# EAGLE design fpgadev_0_2 (EAGLE 5.10)
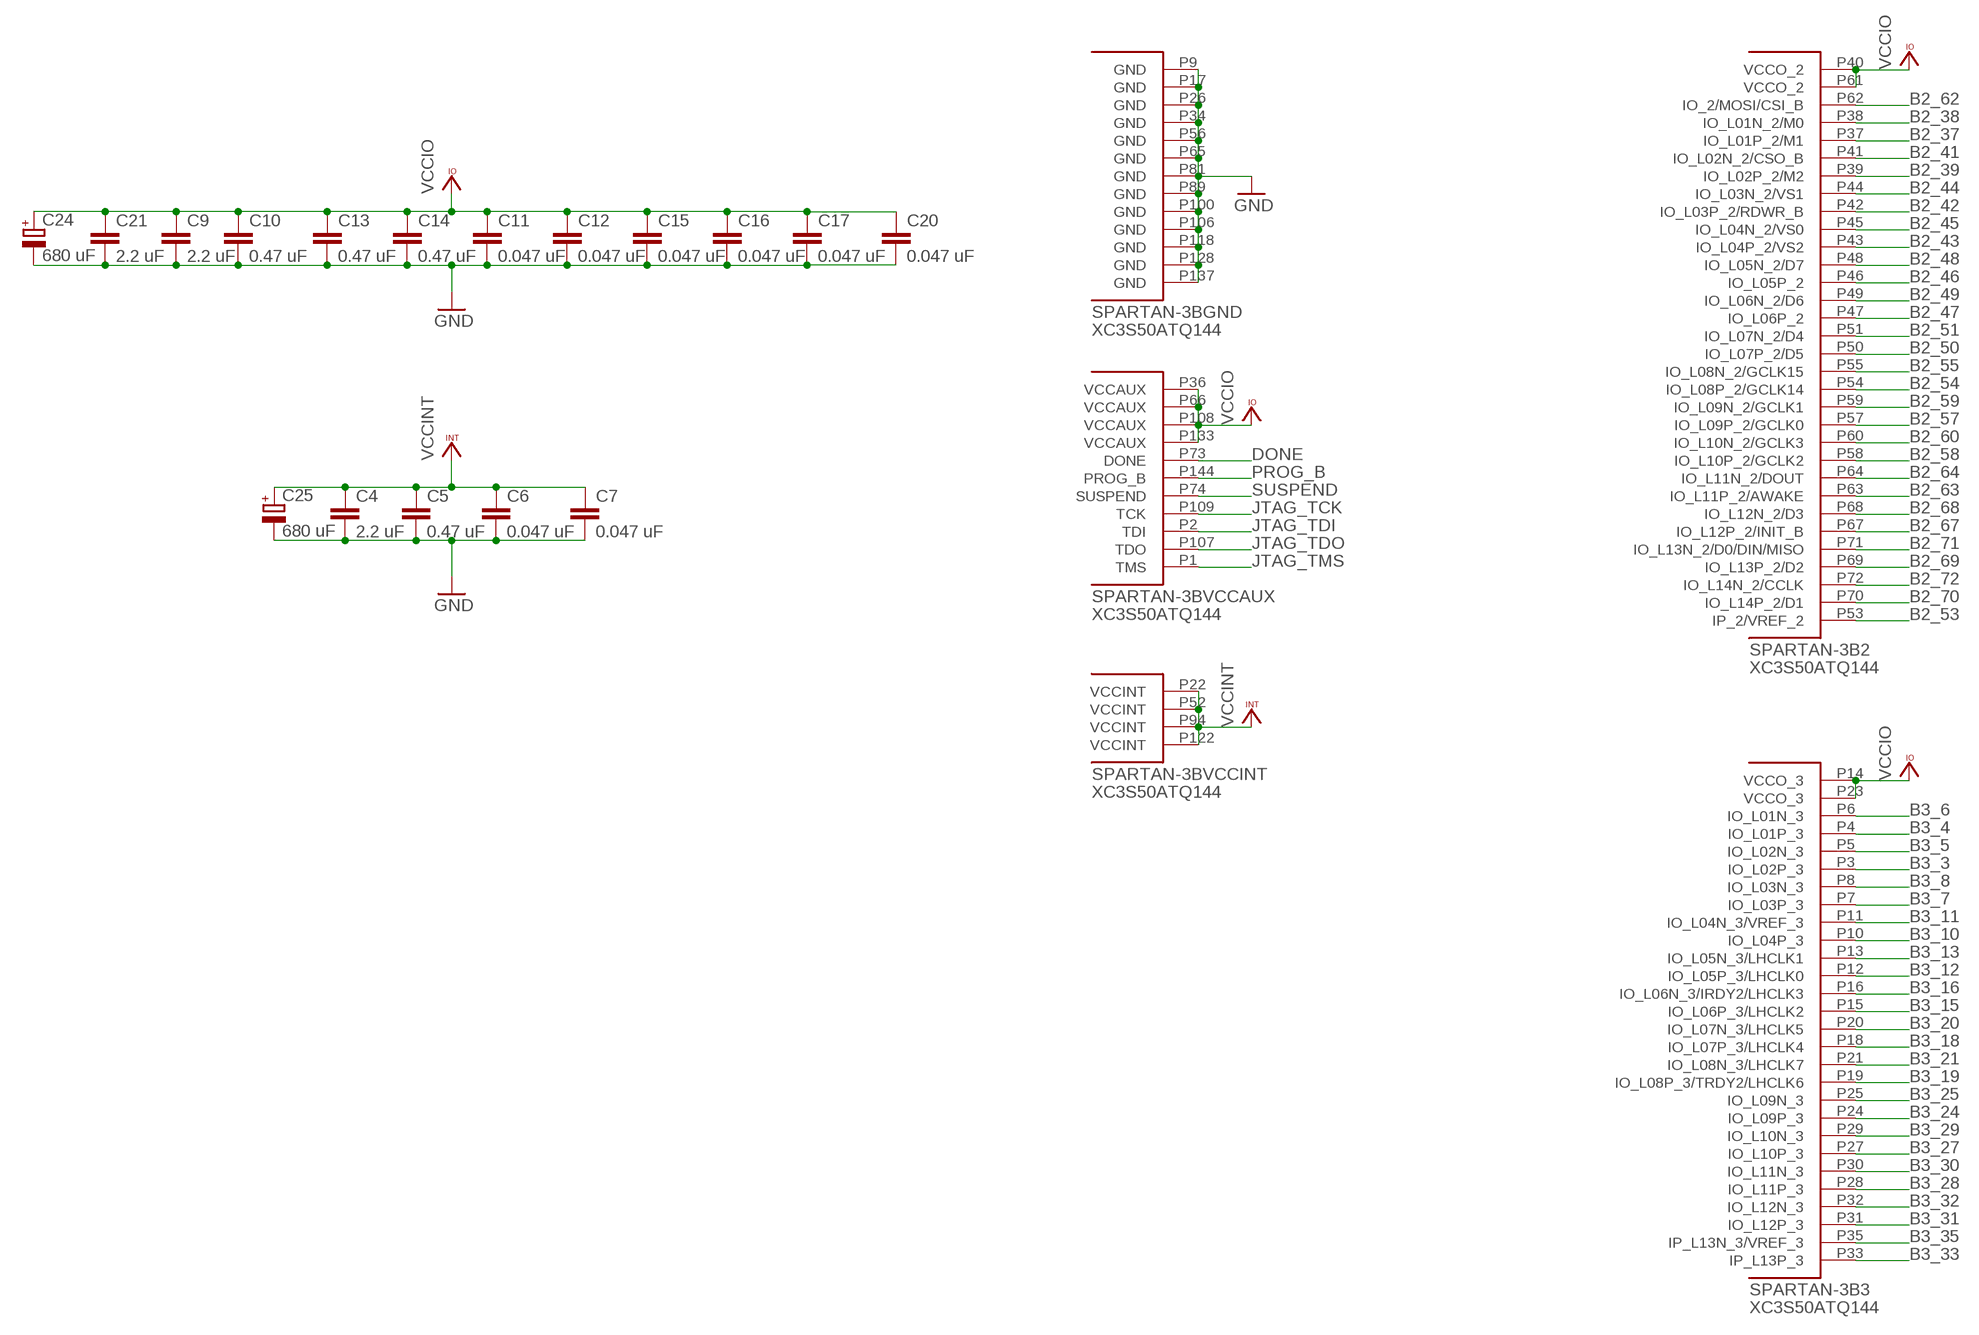
[diagram p0: schematic, sheet 1, part 1 of 2]
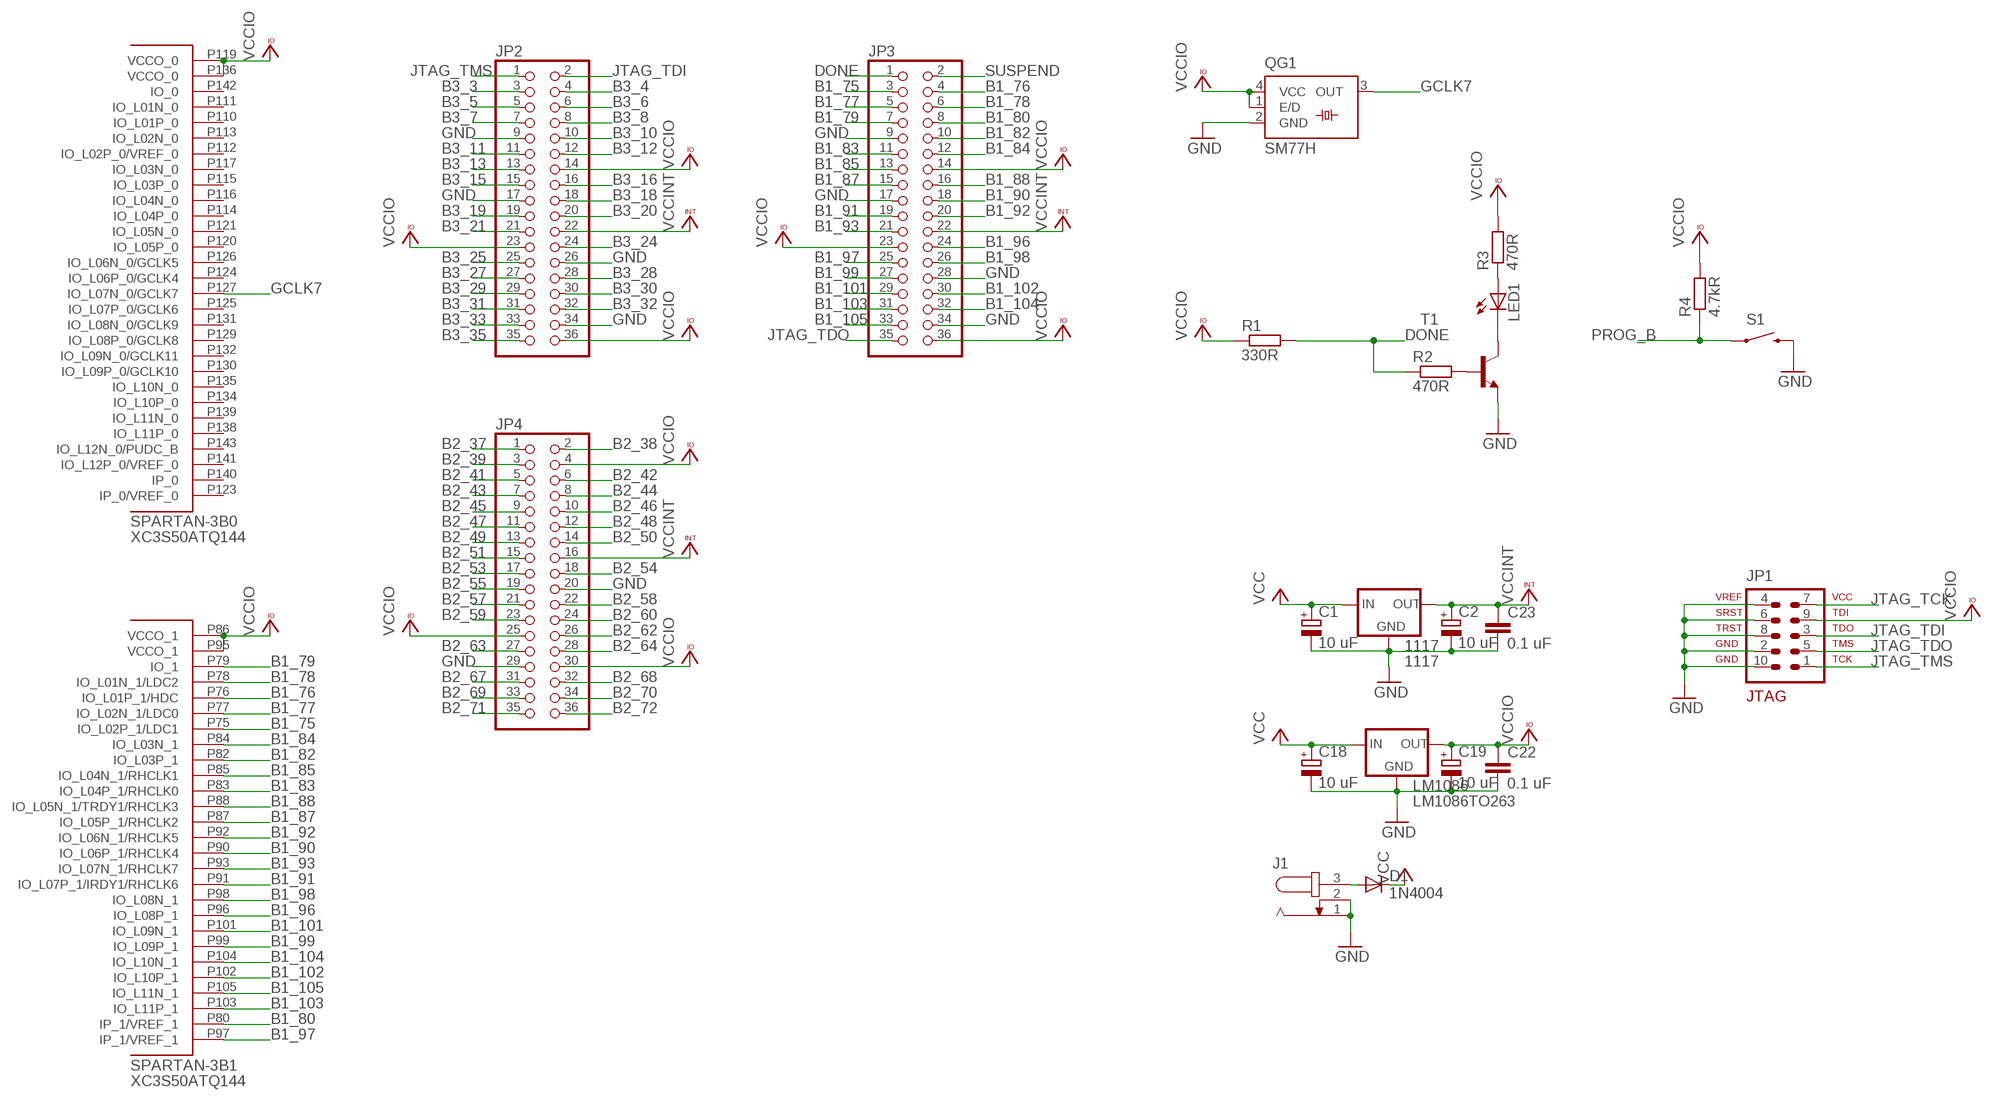
[diagram p1: schematic, sheet 1, part 2 of 2]

## Parts
1117  1117  LM1117TO252  [TO252]
C1  10 uF  CPOL-EUA/3216-18R  [A/3216-18R]
C2  10 uF  CPOL-EUA/3216-18R  [A/3216-18R]
C4  2.2 uF  C-EUC0805  [C0805]
C5  0.47 uF  C-EUC0603  [C0603]
C6  0.047 uF  C-EUC0402  [C0402]
C7  0.047 uF  C-EUC0402  [C0402]
C9  2.2 uF  C-EUC0805  [C0805]
C10  0.47 uF  C-EUC0603  [C0603]
C11  0.047 uF  C-EUC0402  [C0402]
C12  0.047 uF  C-EUC0402  [C0402]
C13  0.47 uF  C-EUC0603  [C0603]
C14  0.47 uF  C-EUC0603  [C0603]
C15  0.047 uF  C-EUC0402  [C0402]
C16  0.047 uF  C-EUC0402  [C0402]
C17  0.047 uF  C-EUC0402  [C0402]
C18  10 uF  CPOL-EUA/3216-18R  [A/3216-18R]
C19  10 uF  CPOL-EUA/3216-18R  [A/3216-18R]
C20  0.047 uF  C-EUC0402  [C0402]
C21  2.2 uF  C-EUC0805  [C0805]
C22  0.1 uF  C-EUC0805  [C0805]
C23  0.1 uF  C-EUC0805  [C0805]
C24  680 uF  CPOL-EUCT7343  [CT7343]
C25  680 uF  CPOL-EUCT7343  [CT7343]
D1  1N4004  [DO41-10]
J1  JACK-PLUG0  [SPC4077]
JP1  AVR-JTAG-10  [AVR-JTAG-10]
JP2  PINHD-2X18  [2X18]
JP3  PINHD-2X18  [2X18]
JP4  PINHD-2X18  [2X18]
LED1  LEDCHIP-LED0805  [CHIP-LED0805]
LM1086  LM1086TO263  [TO263]
QG1  SM77H  [SM77H]
R1  330R  R-EU_R0805  [R0805]
R2  470R  R-EU_R0805  [R0805]
R3  470R  R-EU_R0805  [R0805]
R4  4.7kR  R-EU_R0805  [R0805]
S1  SWITCH-MOMENTARY-2SMD  [TACTILE_SWITCH_SMD]
SPARTAN-3  XC3S50ATQ144  [TQ144]
T1  -NPN-SOT23-EBC  [SOT23-EBC]

## Nets
B1_75: JP3.3 SPARTAN-3.P75(B1:IO_L02P_1/LDC1)
B1_76: JP3.4 SPARTAN-3.P76(B1:IO_L01P_1/HDC)
B1_77: JP3.5 SPARTAN-3.P77(B1:IO_L02N_1/LDC0)
B1_78: JP3.6 SPARTAN-3.P78(B1:IO_L01N_1/LDC2)
B1_79: JP3.7 SPARTAN-3.P79(B1:IO_1)
B1_80: JP3.8 SPARTAN-3.P80(B1:IP_1/VREF_1)
B1_82: JP3.10 SPARTAN-3.P82(B1:IO_L03P_1)
B1_83: JP3.11 SPARTAN-3.P83(B1:IO_L04P_1/RHCLK0)
B1_84: JP3.12 SPARTAN-3.P84(B1:IO_L03N_1)
B1_85: JP3.13 SPARTAN-3.P85(B1:IO_L04N_1/RHCLK1)
B1_87: JP3.15 SPARTAN-3.P87(B1:IO_L05P_1/RHCLK2)
B1_88: JP3.16 SPARTAN-3.P88(B1:IO_L05N_1/TRDY1/RHCLK3)
B1_90: JP3.18 SPARTAN-3.P90(B1:IO_L06P_1/RHCLK4)
B1_91: JP3.19 SPARTAN-3.P91(B1:IO_L07P_1/IRDY1/RHCLK6)
B1_92: JP3.20 SPARTAN-3.P92(B1:IO_L06N_1/RHCLK5)
B1_93: JP3.21 SPARTAN-3.P93(B1:IO_L07N_1/RHCLK7)
B1_96: JP3.24 SPARTAN-3.P96(B1:IO_L08P_1)
B1_97: JP3.25 SPARTAN-3.P97(B1:IP_1/VREF_1)
B1_98: JP3.26 SPARTAN-3.P98(B1:IO_L08N_1)
B1_99: JP3.27 SPARTAN-3.P99(B1:IO_L09P_1)
B1_101: JP3.29 SPARTAN-3.P101(B1:IO_L09N_1)
B1_102: JP3.30 SPARTAN-3.P102(B1:IO_L10P_1)
B1_103: JP3.31 SPARTAN-3.P103(B1:IO_L11P_1)
B1_104: JP3.32 SPARTAN-3.P104(B1:IO_L10N_1)
B1_105: JP3.33 SPARTAN-3.P105(B1:IO_L11N_1)
B2_37: JP4.1 SPARTAN-3.P37(B2:IO_L01P_2/M1)
B2_38: JP4.2 SPARTAN-3.P38(B2:IO_L01N_2/M0)
B2_39: JP4.3 SPARTAN-3.P39(B2:IO_L02P_2/M2)
B2_41: JP4.5 SPARTAN-3.P41(B2:IO_L02N_2/CSO_B)
B2_42: JP4.6 SPARTAN-3.P42(B2:IO_L03P_2/RDWR_B)
B2_43: JP4.7 SPARTAN-3.P43(B2:IO_L04P_2/VS2)
B2_44: JP4.8 SPARTAN-3.P44(B2:IO_L03N_2/VS1)
B2_45: JP4.9 SPARTAN-3.P45(B2:IO_L04N_2/VS0)
B2_46: JP4.10 SPARTAN-3.P46(B2:IO_L05P_2)
B2_47: JP4.11 SPARTAN-3.P47(B2:IO_L06P_2)
B2_48: JP4.12 SPARTAN-3.P48(B2:IO_L05N_2/D7)
B2_49: JP4.13 SPARTAN-3.P49(B2:IO_L06N_2/D6)
B2_50: JP4.14 SPARTAN-3.P50(B2:IO_L07P_2/D5)
B2_51: JP4.15 SPARTAN-3.P51(B2:IO_L07N_2/D4)
B2_53: JP4.17 SPARTAN-3.P53(B2:IP_2/VREF_2)
B2_54: JP4.18 SPARTAN-3.P54(B2:IO_L08P_2/GCLK14)
B2_55: JP4.19 SPARTAN-3.P55(B2:IO_L08N_2/GCLK15)
B2_57: JP4.21 SPARTAN-3.P57(B2:IO_L09P_2/GCLK0)
B2_58: JP4.22 SPARTAN-3.P58(B2:IO_L10P_2/GCLK2)
B2_59: JP4.23 SPARTAN-3.P59(B2:IO_L09N_2/GCLK1)
B2_60: JP4.24 SPARTAN-3.P60(B2:IO_L10N_2/GCLK3)
B2_62: JP4.26 SPARTAN-3.P62(B2:IO_2/MOSI/CSI_B)
B2_63: JP4.27 SPARTAN-3.P63(B2:IO_L11P_2/AWAKE)
B2_64: JP4.28 SPARTAN-3.P64(B2:IO_L11N_2/DOUT)
B2_67: JP4.31 SPARTAN-3.P67(B2:IO_L12P_2/INIT_B)
B2_68: JP4.32 SPARTAN-3.P68(B2:IO_L12N_2/D3)
B2_69: JP4.33 SPARTAN-3.P69(B2:IO_L13P_2/D2)
B2_70: JP4.34 SPARTAN-3.P70(B2:IO_L14P_2/D1)
B2_71: JP4.35 SPARTAN-3.P71(B2:IO_L13N_2/D0/DIN/MISO)
B2_72: JP4.36 SPARTAN-3.P72(B2:IO_L14N_2/CCLK)
B3_3: JP2.3 SPARTAN-3.P3(B3:IO_L02P_3)
B3_4: JP2.4 SPARTAN-3.P4(B3:IO_L01P_3)
B3_5: JP2.5 SPARTAN-3.P5(B3:IO_L02N_3)
B3_6: JP2.6 SPARTAN-3.P6(B3:IO_L01N_3)
B3_7: JP2.7 SPARTAN-3.P7(B3:IO_L03P_3)
B3_8: JP2.8 SPARTAN-3.P8(B3:IO_L03N_3)
B3_10: JP2.10 SPARTAN-3.P10(B3:IO_L04P_3)
B3_11: JP2.11 SPARTAN-3.P11(B3:IO_L04N_3/VREF_3)
B3_12: JP2.12 SPARTAN-3.P12(B3:IO_L05P_3/LHCLK0)
B3_13: JP2.13 SPARTAN-3.P13(B3:IO_L05N_3/LHCLK1)
B3_15: JP2.15 SPARTAN-3.P15(B3:IO_L06P_3/LHCLK2)
B3_16: JP2.16 SPARTAN-3.P16(B3:IO_L06N_3/IRDY2/LHCLK3)
B3_18: JP2.18 SPARTAN-3.P18(B3:IO_L07P_3/LHCLK4)
B3_19: JP2.19 SPARTAN-3.P19(B3:IO_L08P_3/TRDY2/LHCLK6)
B3_20: JP2.20 SPARTAN-3.P20(B3:IO_L07N_3/LHCLK5)
B3_21: JP2.21 SPARTAN-3.P21(B3:IO_L08N_3/LHCLK7)
B3_24: JP2.24 SPARTAN-3.P24(B3:IO_L09P_3)
B3_25: JP2.25 SPARTAN-3.P25(B3:IO_L09N_3)
B3_27: JP2.27 SPARTAN-3.P27(B3:IO_L10P_3)
B3_28: JP2.28 SPARTAN-3.P28(B3:IO_L11P_3)
B3_29: JP2.29 SPARTAN-3.P29(B3:IO_L10N_3)
B3_30: JP2.30 SPARTAN-3.P30(B3:IO_L11N_3)
B3_31: JP2.31 SPARTAN-3.P31(B3:IO_L12P_3)
B3_32: JP2.32 SPARTAN-3.P32(B3:IO_L12N_3)
B3_33: JP2.33 SPARTAN-3.P33(B3:IP_L13P_3)
B3_35: JP2.35 SPARTAN-3.P35(B3:IP_L13N_3/VREF_3)
DONE: JP3.1 R1.2 R2.1 SPARTAN-3.P73(BVCCAUX:DONE)
GCLK7: QG1.3(OUT) SPARTAN-3.P127(B0:IO_L07N_0/GCLK7)
GND: 1117.1(GND) C1.- C2.- C4.2 C5.2 C6.2 C7.2 C9.2 C10.2 C11.2 C12.2 C13.2 C14.2 C15.2 C16.2 C17.2 C18.- C19.- C20.2 C21.2 C22.2 C23.2 C24.- C25.- J1.1 J1.2 JP1.2 JP1.4 JP1.6 JP1.8 JP1.10 JP2.9 JP2.17 JP2.26 JP2.34 JP3.9 JP3.17 JP3.28 JP3.34 JP4.20 JP4.29 LM1086.1(GND) QG1.2(GND) S1.3 SPARTAN-3.P9(BGND:GND) SPARTAN-3.P17(BGND:GND) SPARTAN-3.P26(BGND:GND) SPARTAN-3.P34(BGND:GND) SPARTAN-3.P56(BGND:GND) SPARTAN-3.P65(BGND:GND) SPARTAN-3.P81(BGND:GND) SPARTAN-3.P89(BGND:GND) SPARTAN-3.P100(BGND:GND) SPARTAN-3.P106(BGND:GND) SPARTAN-3.P118(BGND:GND) SPARTAN-3.P128(BGND:GND) SPARTAN-3.P137(BGND:GND) T1.E
JTAG_TCK: JP1.7 SPARTAN-3.P109(BVCCAUX:TCK)
JTAG_TDI: JP1.3 JP2.2 SPARTAN-3.P2(BVCCAUX:TDI)
JTAG_TDO: JP1.5 JP3.35 SPARTAN-3.P107(BVCCAUX:TDO)
JTAG_TMS: JP1.1 JP2.1 SPARTAN-3.P1(BVCCAUX:TMS)
N$1: D1.A J1.3
N$4: R2.2 T1.B
N$5: LED1.C T1.C
N$6: LED1.A R3.1
PROG_B: R4.1 S1.1 SPARTAN-3.P144(BVCCAUX:PROG_B)
SUSPEND: JP3.2 SPARTAN-3.P74(BVCCAUX:SUSPEND)
VCC: 1117.2(IN) C1.+ C18.+ D1.C LM1086.3(IN)
VCCINT: 1117.3(OUT) C2.+ C4.1 C5.1 C6.1 C7.1 C23.1 C25.+ JP2.22 JP3.22 JP4.16 SPARTAN-3.P22(BVCCINT:VCCINT) SPARTAN-3.P52(BVCCINT:VCCINT) SPARTAN-3.P94(BVCCINT:VCCINT) SPARTAN-3.P122(BVCCINT:VCCINT)
VCCIO: C9.1 C10.1 C11.1 C12.1 C13.1 C14.1 C15.1 C16.1 C17.1 C19.+ C20.1 C21.1 C22.1 C24.+ JP1.9 JP2.14 JP2.23 JP2.36 JP3.14 JP3.23 JP3.36 JP4.4 JP4.25 JP4.30 LM1086.2(OUT) QG1.1(E/D) QG1.4(VCC) R1.1 R3.2 R4.2 SPARTAN-3.P14(B3:VCCO_3) SPARTAN-3.P23(B3:VCCO_3) SPARTAN-3.P36(BVCCAUX:VCCAUX) SPARTAN-3.P40(B2:VCCO_2) SPARTAN-3.P61(B2:VCCO_2) SPARTAN-3.P66(BVCCAUX:VCCAUX) SPARTAN-3.P86(B1:VCCO_1) SPARTAN-3.P95(B1:VCCO_1) SPARTAN-3.P108(BVCCAUX:VCCAUX) SPARTAN-3.P119(B0:VCCO_0) SPARTAN-3.P133(BVCCAUX:VCCAUX) SPARTAN-3.P136(B0:VCCO_0)
Unconnected: SPARTAN-3.P110(B0:IO_L01P_0) SPARTAN-3.P111(B0:IO_L01N_0) SPARTAN-3.P112(B0:IO_L02P_0/VREF_0) SPARTAN-3.P113(B0:IO_L02N_0) SPARTAN-3.P114(B0:IO_L04P_0) SPARTAN-3.P115(B0:IO_L03P_0) SPARTAN-3.P116(B0:IO_L04N_0) SPARTAN-3.P117(B0:IO_L03N_0) SPARTAN-3.P120(B0:IO_L05P_0) SPARTAN-3.P121(B0:IO_L05N_0) SPARTAN-3.P123(B0:IP_0/VREF_0) SPARTAN-3.P124(B0:IO_L06P_0/GCLK4) SPARTAN-3.P125(B0:IO_L07P_0/GCLK6) SPARTAN-3.P126(B0:IO_L06N_0/GCLK5) SPARTAN-3.P129(B0:IO_L08P_0/GCLK8) SPARTAN-3.P130(B0:IO_L09P_0/GCLK10) SPARTAN-3.P131(B0:IO_L08N_0/GCLK9) SPARTAN-3.P132(B0:IO_L09N_0/GCLK11) SPARTAN-3.P134(B0:IO_L10P_0) SPARTAN-3.P135(B0:IO_L10N_0) SPARTAN-3.P138(B0:IO_L11P_0) SPARTAN-3.P139(B0:IO_L11N_0) SPARTAN-3.P140(B0:IP_0) SPARTAN-3.P141(B0:IO_L12P_0/VREF_0) SPARTAN-3.P142(B0:IO_0) SPARTAN-3.P143(B0:IO_L12N_0/PUDC_B)

## Library data of the parts
1117 = v-reg-2:LM1117
C1 C2 C18 C19 C24 C25 = rcl:CPOL-EU: POLARIZED CAPACITOR, European symbol
C4-C7 C9-C17 C20-C23 = rcl:C-EU: CAPACITOR, European symbol
D1 = diode:1N4004: DIODE general purpose rectifier, 1 A
J1 = con-jack:JACK-PLUG: DC POWER JACK Power Jack, DC, Right Angle, Through Hole, Rated 5A at 16VDC, PC Terminals Distributor: Farnell (www.Farnell.de) Drawing: 84N1161.pdf / 84N1162.pdf Manufacturer: SPC Technology (www.spctechnology.com) Type: SPC4077 / SPC 4078
JP1 = atmel-1:AVR-JTAG-10: AVR JTAG Debug/Programming Header
JP2-JP4 = pinhead:PINHD-2X18: PIN HEADER
LED1 = led:LED: LED OSRAM: - CHIPLED LG R971, LG N971, LY N971, LG Q971, LY Q971, LO R971, LY R971 LH N974, LH R974 LS Q976, LO Q976, LY Q976 LO Q996 - Hyper CHIPLED LW Q18S LB Q993, LB Q99A, LB R99A - SideLED LS A670, LO A670, LY A670, LG A670, LP A670 LB A673, LV A673, LT A673, LW A673 LH A674 LY A675 LS A676, LA A676, LO A676, LY A676, LW A676 LS A679, LY A679, LG A679 - Hyper Micro SIDELED® LS Y876, LA Y876, LO Y876, LY Y876 LT Y87S - SmartLED LW L88C, LW L88S LB L89C, LB L89S, LG L890 LS L89K, LO L89K, LY L89K LS L896, LA L896, LO L896, LY L896 - TOPLED LS T670, LO T670, LY T670, LG T670, LP T670 LSG T670, LSP T670, LSY T670, LOP T670, LYG T670 LG T671, LOG T671, LSG T671 LB T673, LV T673, LT T673, LW T673 LH T674 LS T676, LA T676, LO T676, LY T676, LB T676, LH T676, LSB T676, LW T676 LB T67C, LV T67C, LT T67C, LS T67K, LO T67K, LY T67K, LW E67C LS E67B, LA E67B, LO E67B, LY E67B, LB E67C, LV E67C, LT E67C LW T67C LS T679, LY T679, LG T679 LS T770, LO T770, LY T770, LG T770, LP T770 LB T773, LV T773, LT T773, LW T773 LH T774 LS E675, LA E675, LY E675, LS T675 LS T776, LA T776, LO T776, LY T776, LB T776 LHGB T686 LT T68C, LB T68C - Hyper Mini TOPLED® LB M676 - Mini TOPLED Santana® LG M470 LS M47K, LO M47K, LY M47K Source: http://www.osram.convergy.de LUXEON: - LUMILED® LXK2-PW12-R00, LXK2-PW12-S00, LXK2-PW14-U00, LXK2-PW14-V00 LXK2-PM12-R00, LXK2-PM12-S00, LXK2-PM14-U00 LXK2-PE12-Q00, LXK2-PE12-R00, LXK2-PE12-S00, LXK2-PE14-T00, LXK2-PE14-U00 LXK2-PB12-K00, LXK2-PB12-L00, LXK2-PB12-M00, LXK2-PB14-N00, LXK2-PB14-P00, LXK2-PB14-Q00 LXK2-PR12-L00, LXK2-PR12-M00, LXK2-PR14-Q00, LXK2-PR14-R00 LXK2-PD12-Q00, LXK2-PD12-R00, LXK2-PD12-S00 LXK2-PH12-R00, LXK2-PH12-S00 LXK2-PL12-P00, LXK2-PL12-Q00, LXK2-PL12-R00 Source: www.luxeon.com KINGBRIGHT: KA-3528ASYC Source: www.kingbright.com
LM1086 = v-reg-2:LM1086
QG1 = crystal:SM77H: 3.3V CMOS Clock Oscillator Source: www.pletronics.com .. sm77h%203.3v.pdf
R1-R4 = rcl:R-EU_: RESISTOR, European symbol
S1 = SparkFun:SWITCH-MOMENTARY-2
SPARTAN-3 = xilinx_devices:XC3S50ATQ144: Xilinx FPGA: XC3S50ATQ144
T1 = transistor:*-NPN-: NPN Transistror BF959 corrected 2008.03.06

## Board
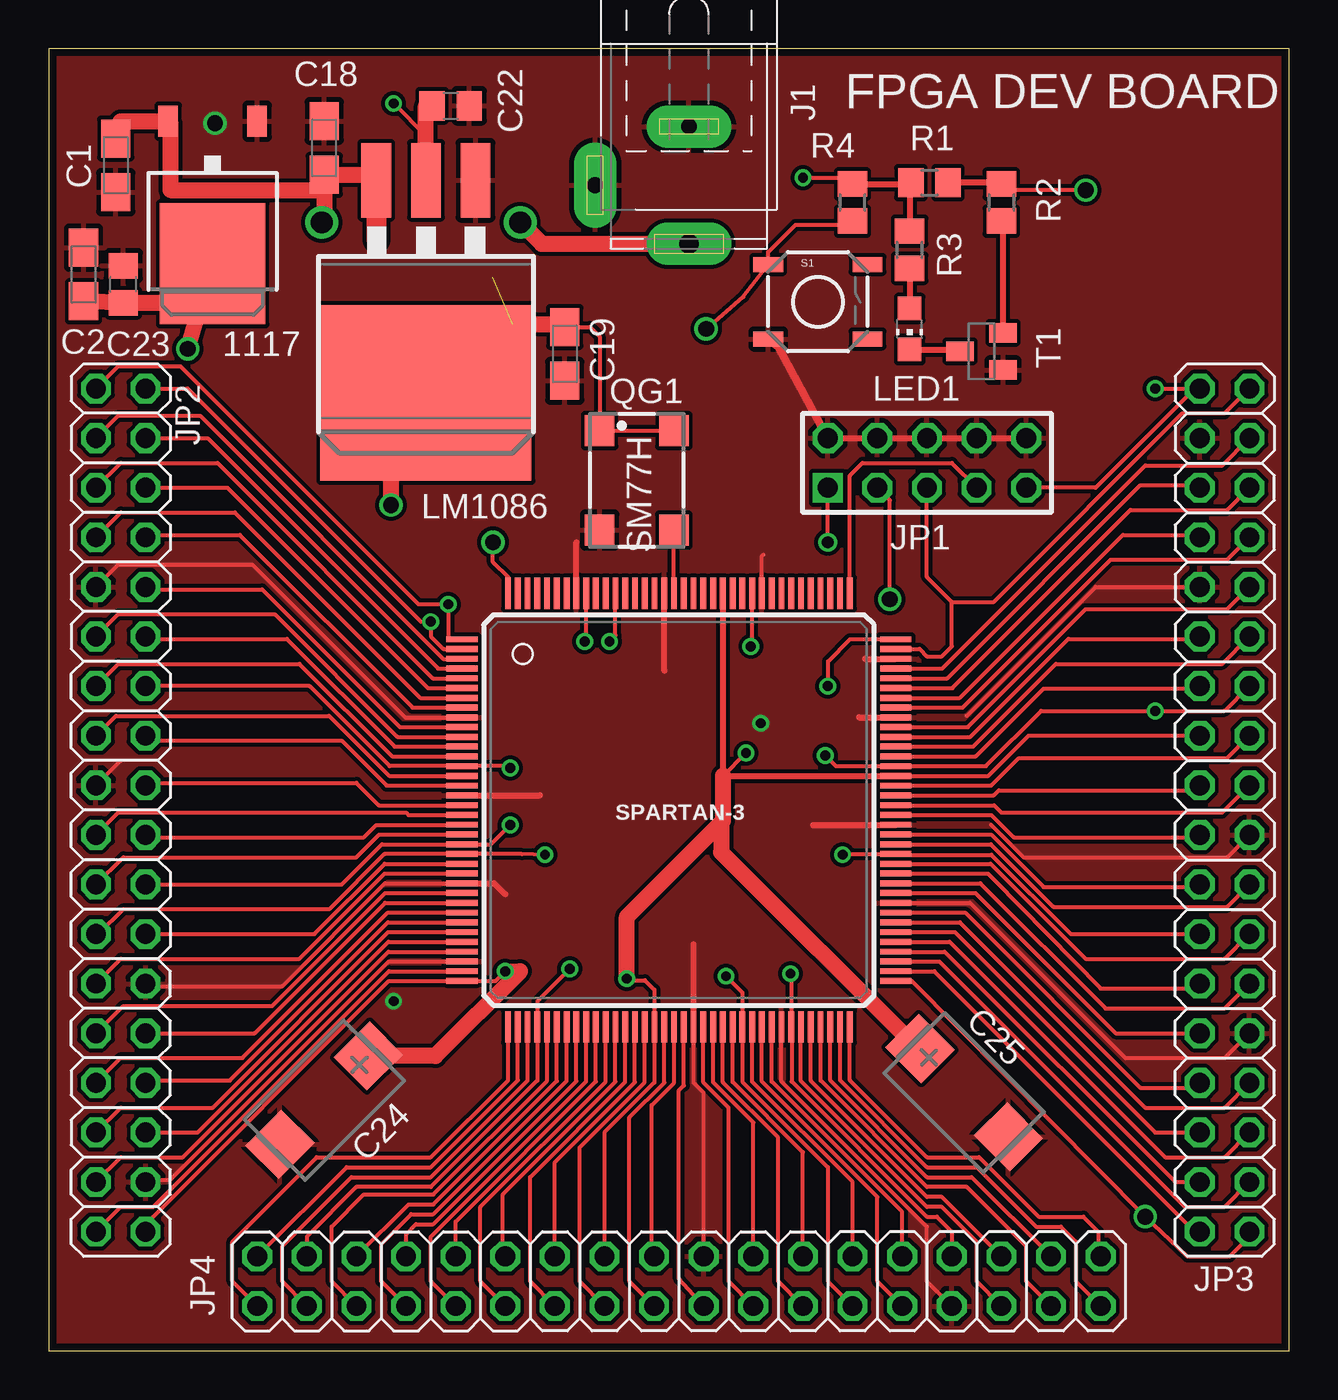
[diagram p2: board, top side]
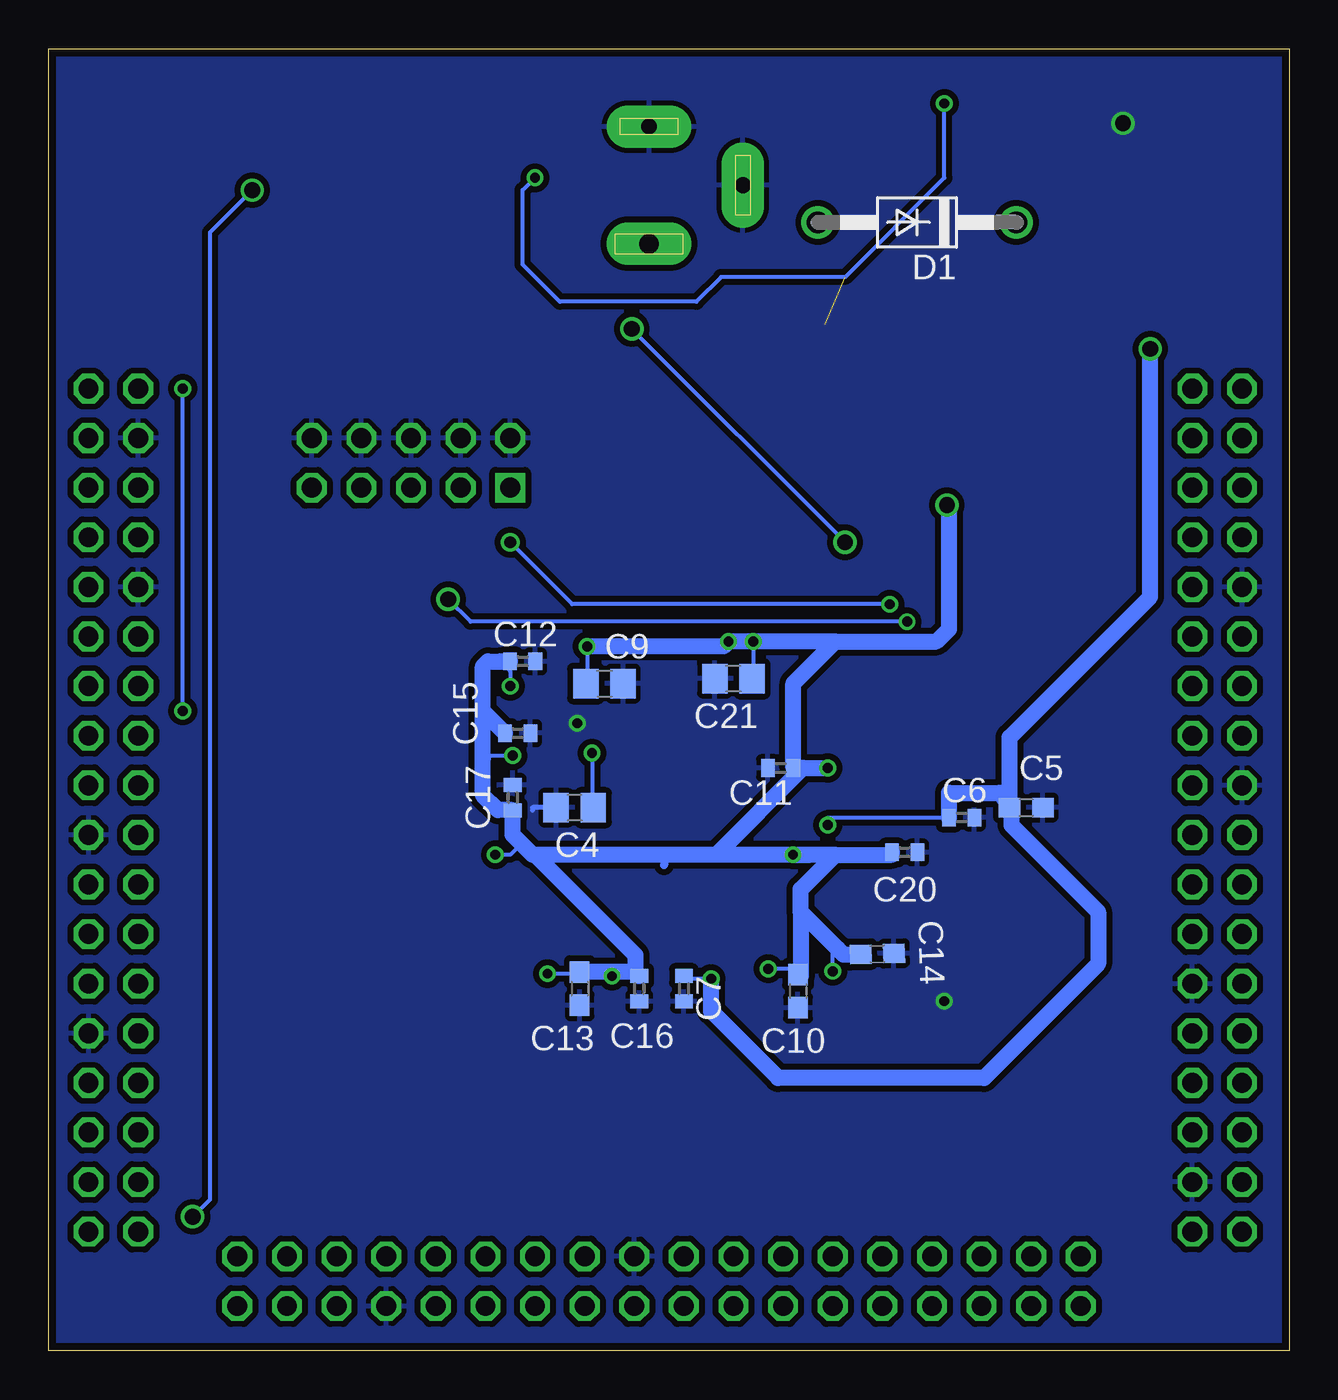
[diagram p3: board, bottom side, seen from below]

Size 63.5 x 66.67 mm. Coordinates in mm from the lower left corner, seen from the top.
Outline: 0,0 63.5,0 63.5,66.67 0,66.67 0,0
Copper layers (1*16): Top 0.0356mm / dielectric 1.5011mm / Bottom 0.0356mm
Design rules "LaenPCBOrder": minimum track width 6mil, minimum drill 13mil, track to track 6mil, track to pad 6mil, pad to pad 6mil, via to via 6mil, smd to smd 6mil, copper to edge 15mil, drill to drill 6mil, minimum pad ring 7mil, minimum via ring 7mil, stop-mask expansion 4mil, vias tented up to drill 0mil, thermal gap 10mil

### Footprints (pad centres in the part's own frame; a part is rotated, then mirrored left to right if it is on the bottom)
TO252 = smd 1 x 1.6: 1 -2.28,-6.07; 2 2.28,-6.07 | smd 5.4 x 6.2: 3 0,1.23
A/3216-18R = smd 1.95 x 1.5: + 1.375,0; - -1.375,0
C0805 = smd 1.3 x 1.5: 1 -0.95,0; 2 0.95,0
C0603 = smd 1.1 x 1: 1 -0.85,0; 2 0.85,0
C0402 = smd 0.7 x 0.9: 1 -0.65,0; 2 0.65,0
CT7343 = smd 2.6 x 2.4: + -3.2,0; - 3.2,0
DO41-10 = drill 1.118 round: A 5.08,0; C -5.08,0
SPC4077 = drill 0.8 pad 2.184 long: 1 -3,0; 2 0,-4.8 | drill 1 pad 2.184 long: 3 3,0
AVR-JTAG-10 = drill 1.016 square: 1 -5.08,-1.27 | drill 1.016 octagon: 2 -5.08,1.27; 3 -2.54,-1.27; 4 -2.54,1.27; 5 0,-1.27; 6 0,1.27; 7 2.54,-1.27; 8 2.54,1.27; 9 5.08,-1.27; 10 5.08,1.27
2X18 = drill 1.016 octagon: 1 -21.59,-1.27; 2 -21.59,1.27; 3 -19.05,-1.27; 4 -19.05,1.27; 5 -16.51,-1.27; 6 -16.51,1.27; 7 -13.97,-1.27; 8 -13.97,1.27; 9 -11.43,-1.27; 10 -11.43,1.27; 11 -8.89,-1.27; 12 -8.89,1.27; 13 -6.35,-1.27; 14 -6.35,1.27; 15 -3.81,-1.27; 16 -3.81,1.27; 17 -1.27,-1.27; 18 -1.27,1.27; 19 1.27,-1.27; 20 1.27,1.27; 21 3.81,-1.27; 22 3.81,1.27; 23 6.35,-1.27; 24 6.35,1.27; 25 8.89,-1.27; 26 8.89,1.27; 27 11.43,-1.27; 28 11.43,1.27; 29 13.97,-1.27; 30 13.97,1.27; 31 16.51,-1.27; 32 16.51,1.27; 33 19.05,-1.27; 34 19.05,1.27; 35 21.59,-1.27; 36 21.59,1.27
CHIP-LED0805 = smd 1.2 x 1.2: A 0,-1.05; C 0,1.05
TO263 = smd 1.524 x 3.81: 1 -2.54,-8.255; 2 0,-8.255; 3 2.54,-8.255 | smd 10.8 x 9: 4 0,2.635
SM77H = smd 1.6 x 1.5: 1 -2.55,-1.9; 2 2.55,-1.9; 3 2.55,1.9; 4 -2.55,1.9
R0805 = smd 1.3 x 1.5: 1 -0.95,0; 2 0.95,0
TACTILE_SWITCH_SMD = smd 1.524 x 0.762: 1 -2.54,1.905; 2 2.54,1.905; 3 -2.54,-1.905; 4 2.54,-1.905
TQ144 = smd 1.6 x 0.3: P1 -11.1,8.75; P2 -11.1,8.25; P3 -11.1,7.75; P4 -11.1,7.25; P5 -11.1,6.75; P6 -11.1,6.25; P7 -11.1,5.75; P8 -11.1,5.25; P9 -11.1,4.75; P10 -11.1,4.25; P11 -11.1,3.75; P12 -11.1,3.25; P13 -11.1,2.75; P14 -11.1,2.25; P15 -11.1,1.75; P16 -11.1,1.25; P17 -11.1,0.75; P18 -11.1,0.25; P19 -11.1,-0.25; P20 -11.1,-0.75; P21 -11.1,-1.25; P22 -11.1,-1.75; P23 -11.1,-2.25; P24 -11.1,-2.75; P25 -11.1,-3.25; P26 -11.1,-3.75; P27 -11.1,-4.25; P28 -11.1,-4.75; P29 -11.1,-5.25; P30 -11.1,-5.75; P31 -11.1,-6.25; P32 -11.1,-6.75; P33 -11.1,-7.25; P34 -11.1,-7.75; P35 -11.1,-8.25; P36 -11.1,-8.75; P73 11.1,-8.75; P74 11.1,-8.25; P75 11.1,-7.75; P76 11.1,-7.25; P77 11.1,-6.75; P78 11.1,-6.25; P79 11.1,-5.75; P80 11.1,-5.25; P81 11.1,-4.75; P82 11.1,-4.25; P83 11.1,-3.75; P84 11.1,-3.25; P85 11.1,-2.75; P86 11.1,-2.25; P87 11.1,-1.75; P88 11.1,-1.25; P89 11.1,-0.75; P90 11.1,-0.25; P91 11.1,0.25; P92 11.1,0.75; P93 11.1,1.25; P94 11.1,1.75; P95 11.1,2.25; P96 11.1,2.75; P97 11.1,3.25; P98 11.1,3.75; P99 11.1,4.25; P100 11.1,4.75; P101 11.1,5.25; P102 11.1,5.75; P103 11.1,6.25; P104 11.1,6.75; P105 11.1,7.25; P106 11.1,7.75; P107 11.1,8.25; P108 11.1,8.75 | smd 0.3 x 1.6: P37 -8.75,-11.1; P38 -8.25,-11.1; P39 -7.75,-11.1; P40 -7.25,-11.1; P41 -6.75,-11.1; P42 -6.25,-11.1; P43 -5.75,-11.1; P44 -5.25,-11.1; P45 -4.75,-11.1; P46 -4.25,-11.1; P47 -3.75,-11.1; P48 -3.25,-11.1; P49 -2.75,-11.1; P50 -2.25,-11.1; P51 -1.75,-11.1; P52 -1.25,-11.1; P53 -0.75,-11.1; P54 -0.25,-11.1; P55 0.25,-11.1; P56 0.75,-11.1; P57 1.25,-11.1; P58 1.75,-11.1; P59 2.25,-11.1; P60 2.75,-11.1; P61 3.25,-11.1; P62 3.75,-11.1; P63 4.25,-11.1; P64 4.75,-11.1; P65 5.25,-11.1; P66 5.75,-11.1; P67 6.25,-11.1; P68 6.75,-11.1; P69 7.25,-11.1; P70 7.75,-11.1; P71 8.25,-11.1; P72 8.75,-11.1; P109 8.75,11.1; P110 8.25,11.1; P111 7.75,11.1; P112 7.25,11.1; P113 6.75,11.1; P114 6.25,11.1; P115 5.75,11.1; P116 5.25,11.1; P117 4.75,11.1; P118 4.25,11.1; P119 3.75,11.1; P120 3.25,11.1; P121 2.75,11.1; P122 2.25,11.1; P123 1.75,11.1; P124 1.25,11.1; P125 0.75,11.1; P126 0.25,11.1; P127 -0.25,11.1; P128 -0.75,11.1; P129 -1.25,11.1; P130 -1.75,11.1; P131 -2.25,11.1; P132 -2.75,11.1; P133 -3.25,11.1; P134 -3.75,11.1; P135 -4.25,11.1; P136 -4.75,11.1; P137 -5.25,11.1; P138 -5.75,11.1; P139 -6.25,11.1; P140 -6.75,11.1; P141 -7.25,11.1; P142 -7.75,11.1; P143 -8.25,11.1; P144 -8.75,11.1
SOT23-EBC = smd 1 x 1.4: B 0.95,-1.1; C 0,1.1; E -0.95,-1.1

### Placement (x,y rotation side)
1117  8.38,56.9 180 top
C1  3.43,60.71 90 top
C2  1.78,55.12 270 top
C4  36.58,27.81 180 bottom
C5  13.46,27.81 0 bottom
C6  16.76,27.3 0 bottom
C7  30.99,18.54 270 bottom
C9  35.05,34.16 0 bottom
C10  25.15,18.41 270 bottom
C11  26.04,29.84 180 bottom
C12  39.24,35.31 0 bottom
C13  36.32,18.54 270 bottom
C14  21.08,20.32 1.9 bottom
C15  39.5,31.62 0 bottom
C16  33.27,18.54 270 bottom
C17  39.75,28.32 90 bottom
C18  14.1,61.59 270 top
C19  26.42,51.05 90 top
C20  19.68,25.53 0 bottom
C21  28.45,34.42 180 bottom
C22  20.57,63.75 0 top
C23  3.81,54.61 90 top
C24  14.1,12.83 225 top
C25  46.86,13.21 315 top
D1  19.05,57.78 180 bottom
J1  32.77,59.69 270 top
JP1  44.96,45.47 0 top
JP2  3.68,27.69 270 top
JP3  60.2,27.69 90 top
JP4  32.26,3.56 0 top
LED1  44.07,52.32 180 top
LM1086  19.3,51.69 180 top
QG1  30.1,44.58 270 top
R1  45.09,59.82 0 top
R2  48.77,58.8 270 top
R3  44.07,56.39 90 top
R4  41.15,58.8 90 top
S1  39.37,53.72 0 top
SPARTAN-3  32.26,27.69 0 top
T1  47.75,51.18 90 top

### Tracks (layer width: path | path; a pad name or v marks a point on that pad's centre or on a via)
B1_75
  Top 0.203: SPARTAN-3.P75 45.6,19.94 58.17,7.37 60.2,7.37 JP3.3
B1_76
  Top 0.203: SPARTAN-3.P76 45.86,20.44 57.66,8.64 JP3.4
B1_77
  Top 0.203: SPARTAN-3.P77 46.12,20.94 57.15,9.91 60.2,9.91 JP3.5
B1_78
  Top 0.203: SPARTAN-3.P78 46.38,21.44 56.64,11.18 JP3.6
B1_79
  Top 0.203: SPARTAN-3.P79 46.64,21.94 56.13,12.45 60.2,12.45 JP3.7
B1_80
  Top 0.203: SPARTAN-3.P80 46.91,22.44 55.88,13.46 58.67,13.46 JP3.8
B1_82
  Top 0.203: SPARTAN-3.P82 47.43,23.44 54.61,16.26 JP3.10
B1_83
  Top 0.203: SPARTAN-3.P83 47.69,23.94 54.1,17.53 60.2,17.53 JP3.11
B1_84
  Top 0.203: 48.38,24.12 48.08,24.44 | 48.38,24.12 53.85,18.54 58.67,18.54 JP3.12 | SPARTAN-3.P84 48.07,24.44 48.38,24.12
B1_85
  Top 0.203: JP3.13 60.2,20.07 53.09,20.07 48.22,24.94 SPARTAN-3.P85
B1_87
  Top 0.203: JP3.15 60.33,22.73 51.44,22.73 48.23,25.94 SPARTAN-3.P87
B1_88
  Top 0.203: JP3.16 58.8,23.75 50.93,23.75 48.24,26.44 SPARTAN-3.P88
B1_90
  Top 0.203: SPARTAN-3.P90 48.26,27.44 49.4,26.29 58.8,26.29 JP3.18
B1_91
  Top 0.203: JP3.19 60.07,27.56 48.77,27.56 48.39,27.94 SPARTAN-3.P91
B1_92
  Top 0.203: JP3.20 58.67,28.7 48.64,28.7 48.38,28.44 44.06,28.44 | 44.06,28.44 44.07,28.45 | SPARTAN-3.P92 44.06,28.44
B1_93
  Top 0.203: JP3.21 60.33,30.35 49.66,30.35 48.24,28.94 SPARTAN-3.P93
B1_96
  Top 0.203: JP3.24 58.8,33.91 50.93,33.91 47.45,30.44 SPARTAN-3.P96
B1_97
  Top 0.203: JP3.25 60.07,35.18 51.56,35.18 47.32,30.94 SPARTAN-3.P97
B1_98
  Top 0.203: JP3.26 58.8,36.45 52.2,36.45 47.18,31.44 SPARTAN-3.P98
B1_99
  Top 0.203: JP3.27 60.33,37.97 53.09,37.97 47.05,31.94 SPARTAN-3.P99
B1_101
  Top 0.203: SPARTAN-3.P101 46.78,32.94 54.36,40.51 60.33,40.51 JP3.29
B1_102
  Top 0.203: SPARTAN-3.P102 46.64,33.44 54.99,41.78 58.8,41.78 JP3.30
B1_103
  Top 0.203: SPARTAN-3.P103 46.26,33.94 55.37,43.05 60.33,43.05 JP3.31
B1_104
  Top 0.203: SPARTAN-3.P104 45.99,34.44 55.88,44.32 58.8,44.32 JP3.32
B1_105
  Top 0.203: SPARTAN-3.P105 45.73,34.94 56.13,45.34 60.07,45.34 JP3.33
B2_37
  Top 0.203: SPARTAN-3.P37 23.51,13.86 19.56,9.91 13.72,9.91 9.4,5.59 9.4,3.56 JP4.1
B2_38
  Top 0.203: JP4.2 15.24,9.4 19.56,9.4 24.01,13.85 SPARTAN-3.P38
B2_39
  Top 0.203: JP4.3 11.94,3.56 11.94,5.33 15.49,8.89 19.56,8.89 24.51,13.84 SPARTAN-3.P39
B2_41
  Top 0.203: JP4.5 14.48,3.56 14.48,6.35 16.13,8 19.68,8 25.51,13.82 SPARTAN-3.P41
B2_42
  Top 0.203: JP4.6 18.41,7.49 19.68,7.49 26.01,13.82 SPARTAN-3.P42
B2_43
  Top 0.203: SPARTAN-3.P43 26.51,13.81 19.68,6.99 18.54,6.99 17.02,5.46 17.02,3.56 JP4.7
B2_44
  Top 0.203: SPARTAN-3.P44 27.01,13.8 19.68,6.48 18.8,6.48 18.29,5.97 JP4.8
B2_45
  Top 0.203: SPARTAN-3.P45 27.51,13.79 19.56,5.84 19.56,3.56 JP4.9
B2_46
  Top 0.203: SPARTAN-3.P46 28.01,13.78 20.83,6.6 JP4.10
B2_47
  Top 0.203: SPARTAN-3.P47 28.51,13.78 22.1,7.37 22.1,3.56 JP4.11
B2_48
  Top 0.203: SPARTAN-3.P48 29.01,13.77 23.24,8 23.24,4.95 JP4.12
B2_49
  Top 0.203: SPARTAN-3.P49 29.51,13.76 24.64,8.89 24.64,3.56 JP4.13
B2_50
  Top 0.203: JP4.14 25.91,9.65 30.01,13.75 SPARTAN-3.P50
B2_51
  Top 0.203: JP4.15 27.18,3.56 27.18,10.41 30.51,13.74 SPARTAN-3.P51
B2_53
  Top 0.203: JP4.17 29.72,3.56 29.72,11.94 31.51,13.73 SPARTAN-3.P53
B2_54
  Top 0.203: JP4.18 30.86,4.95 30.86,12.57 32.01,13.72 SPARTAN-3.P54
B2_55
  Top 0.203: SPARTAN-3.P55 32.51,13.59 32.26,13.34 32.26,3.68 JP4.19
B2_57
  Top 0.203: SPARTAN-3.P57 33.51,13.74 34.8,12.45 34.8,3.56 JP4.21
B2_58
  Top 0.203: SPARTAN-3.P58 34.01,13.74 36.07,11.68 JP4.22
B2_59
  Top 0.203: JP4.23 37.34,3.56 37.34,10.92 34.51,13.75 SPARTAN-3.P59
B2_60
  Top 0.203: JP4.24 38.61,10.16 35.01,13.76 SPARTAN-3.P60
B2_62
  Top 0.203: JP4.26 41.15,8.64 36.01,13.78 SPARTAN-3.P62
B2_63
  Top 0.203: JP4.27 42.42,3.56 42.42,7.87 36.51,13.78 SPARTAN-3.P63
B2_64
  Top 0.203: SPARTAN-3.P64 37.01,13.79 43.69,7.11 JP4.28
B2_67
  Top 0.203: JP4.31 47.5,3.56 47.5,5.59 45.72,7.37 44.96,7.37 38.51,13.82 SPARTAN-3.P67
B2_68
  Top 0.203: SPARTAN-3.P68 39.01,13.82 44.96,7.87 45.72,7.87 JP4.32
B2_69
  Top 0.203: SPARTAN-3.P69 39.51,13.83 44.96,8.38 46.99,8.38 50.04,5.33 50.04,3.56 JP4.33
B2_70
  Top 0.203: SPARTAN-3.P70 40.01,13.84 44.96,8.89 47.24,8.89 JP4.34
B2_71
  Top 0.203: SPARTAN-3.P71 40.51,13.85 44.96,9.4 47.5,9.4 50.55,6.35 51.82,6.35 52.58,5.59 52.58,3.56 JP4.35
B2_72
  Top 0.203: SPARTAN-3.P72 41.01,13.86 44.96,9.91 47.62,9.91 50.67,6.86 52.96,6.86 53.72,6.1 53.72,4.95 JP4.36
B3_3
  Top 0.203: SPARTAN-3.P3 20.19,35.44 7.75,47.88 3.56,47.88 JP2.3
B3_4
  Top 0.203: SPARTAN-3.P4 19.93,34.94 8.13,46.74 JP2.4
B3_5
  Top 0.203: SPARTAN-3.P5 19.67,34.44 8.64,45.47 3.68,45.47 JP2.5
B3_6
  Top 0.203: SPARTAN-3.P6 19.4,33.94 9.14,44.2 JP2.6
B3_7
  Top 0.203: SPARTAN-3.P7 19.02,33.44 9.53,42.93 3.68,42.93 JP2.7
B3_8
  Top 0.203: SPARTAN-3.P8 18.63,32.94 9.78,41.78 5.08,41.78 JP2.8
B3_10
  Top 0.203: SPARTAN-3.P10 17.98,31.94 10.92,38.99 5.08,38.99 JP2.10
B3_11
  Top 0.203: SPARTAN-3.P11 17.84,31.44 11.56,37.72 3.56,37.72 JP2.11
B3_12
  Top 0.203: SPARTAN-3.P12 17.7,30.94 12.19,36.45 5.08,36.45 JP2.12
B3_13
  Top 0.203: JP2.13 3.56,35.18 12.83,35.18 17.57,30.44 SPARTAN-3.P13
B3_15
  Top 0.203: JP2.15 3.43,32.51 14.35,32.51 17.43,29.44 SPARTAN-3.P15
B3_16
  Top 0.203: SPARTAN-3.P16 17.29,28.94 14.99,31.24 5.21,31.24 JP2.16
B3_18
  Top 0.203: SPARTAN-3.P18 16.89,27.94 15.75,29.08 5.08,29.08 JP2.18
B3_19
  Top 0.203: JP2.19 3.56,27.56 18.29,27.56 18.41,27.44 SPARTAN-3.P19
B3_20
  Top 0.203: JP2.20 5.08,26.29 16.13,26.29 16.76,26.92 21.15,26.92 SPARTAN-3.P20
B3_21
  Top 0.203: JP2.21 3.81,25.27 15.75,25.27 16.91,26.44 SPARTAN-3.P21
B3_24
  Top 0.203: JP2.24 13.59,21.34 17.19,24.94 SPARTAN-3.P24
B3_25
  Top 0.203: JP2.25 3.68,20.07 12.83,20.07 17.2,24.44 SPARTAN-3.P25
B3_27
  Top 0.203: SPARTAN-3.P27 17.21,23.44 11.43,17.65 3.81,17.65 JP2.27
B3_28
  Top 0.203: SPARTAN-3.P28 17.22,22.94 10.54,16.26 JP2.28
B3_29
  Top 0.203: SPARTAN-3.P29 17.36,22.44 9.91,14.99 3.68,14.99 JP2.29
B3_30
  Top 0.203: SPARTAN-3.P30 17.36,21.94 9.27,13.84 5.08,13.84 JP2.30
B3_31
  Top 0.203: SPARTAN-3.P31 17.37,21.44 8.38,12.45 3.68,12.45 JP2.31
B3_32
  Top 0.203: SPARTAN-3.P32 17.38,20.94 7.62,11.18 JP2.32
B3_33
  Top 0.203: SPARTAN-3.P33 17.39,20.44 6.86,9.91 3.68,9.91 JP2.33
B3_35
  Top 0.203: JP2.35 3.68,7.37 5.33,7.37 17.4,19.44 SPARTAN-3.P35
DONE  (via drill 0.8)
  Top 0.203: SPARTAN-3.P73 44.18,18.94 v56.13,6.86 58.29,4.83 60.45,4.83 61.47,5.84 JP3.1 | v53.09,59.44 49.08,59.44 R2.1
  Top 0.305: R1.2 48.7,59.82 R2.1
  Bottom 0.203: v53.09,59.44 55.24,57.28 55.24,7.75 v56.13,6.86
GCLK7
  Top 0.203: QG1.3 32,38.8 SPARTAN-3.P127
GND  (via drill 0.5, 0.8)
  Top 0.203: JP4.29 44.96,3.56 44.96,6.35 37.51,13.8 SPARTAN-3.P65 | SPARTAN-3.P56 33.01,13.73 33.53,13.21 JP4.20 | SPARTAN-3.P81 47.17,22.94 55.12,14.99 60.2,14.99 JP3.9 | JP3.17 60.33,25.27 49.91,25.27 48.25,26.94 | 46.99,32.51 53.59,39.12 JP3.28 | SPARTAN-3.P34 17.4,19.94 6.22,8.76 5.08,8.76 JP2.34 | SPARTAN-3.P26 17.2,23.94 11.94,18.67 5.08,18.67 JP2.26 | JP2.17 3.68,30.23 | SPARTAN-3.P9 18.24,32.44 10.41,40.26 3.56,40.26 JP2.9 | SPARTAN-3.P118 36.51,40.7 36.58,40.77
  Top 0.305: SPARTAN-3.P56 33.01,20.82 | 39.12,26.92 43.35,26.92 SPARTAN-3.P89 | 41.79,35.44 SPARTAN-3.P106 | SPARTAN-3.P26 22.8,23.94 23.37,23.37 | 41.48,32.44 SPARTAN-3.P100 | SPARTAN-3.P17 25.13,28.44 | 31.51,34.81 SPARTAN-3.P128 | JP1.2 JP1.4 JP1.6 JP1.8 JP1.10 | SPARTAN-3.P137 27.01,41.4
  Top 0.406: S1.3 37.34,51.44 JP1.2
  Bottom 0.254: C4.2 38.73,27.81 38.73,27.69
  other vias: 17.65,17.91 8.51,62.87 36.45,32.13
  pour Top (isolate 0.203): 0,66.67 63.5,66.67 63.5,0 0,0
  pour Bottom (isolate 0.305): 0,66.67 63.5,66.17 63.5,-0.51 0,0
JTAG_TCK
  Top 0.203: SPARTAN-3.P109 41.01,44.82 41.66,45.47 46.23,45.47 JP1.7
JTAG_TDI  (via drill 0.5, 0.8)
  Top 0.203: SPARTAN-3.P2 20.2,35.94 19.56,36.58 v19.56,37.34 19.05,37.34 7.11,49.28 JP2.2 | v43.05,38.48 43.05,43.56 JP1.3
  Bottom 0.203: v19.56,37.34 41.91,37.34 v43.05,38.48
JTAG_TDO
  Top 0.203: SPARTAN-3.P107 44.58,35.94 44.96,35.56 45.72,35.56 46.23,36.07 46.23,38.35 | 46.23,38.35 48.39,38.35 58.04,48.01 60.2,48.01 JP3.35 | 46.23,38.35 44.96,39.62 JP1.5
JTAG_TMS  (via drill 0.5, 0.6)
  Top 0.203: SPARTAN-3.P1 20.46,36.44 v20.45,38.23 18.92,38.23 6.73,50.42 3.56,50.42 JP2.1 | v39.88,41.4 JP1.1
  Bottom 0.203: v20.45,38.23 36.7,38.23 v39.88,41.4
N$1
  Top 0.813: J1.3 25.23,56.69 D1.A
N$4
  Top 0.305: T1.B 48.85,57.77 R2.2
N$5
  Top 0.305: LED1.C 46.56,51.27 T1.C
N$6
  Top 0.305: R3.1 LED1.A
PROG_B  (via drill 0.8)
  Top 0.203: SPARTAN-3.P144 23.51,39.61 22.73,40.39 v22.73,41.4 | v33.66,52.32 35.56,53.98 S1.1 36.83,56.26 38.23,57.66 40.95,57.66 R4.1
  Bottom 0.203: v22.73,41.4 v33.66,52.32
SUSPEND
  Top 0.203: SPARTAN-3.P74 45.33,19.44 58.67,6.1 JP3.2
VCC
  Top 0.813: C1.+ 3.68,62.97 1117.2 6.22,62.84 6.22,59.44 14.1,59.44 | LM1086.3 16.49,60.22 C18.+ 14.1,59.44 | 14.1,59.44 14.1,57.91 D1.C
  Top 1.016: LM1086.3 16.76,56.9
VCCINT  (via drill 0.5, 0.8)
  Top 0.203: JP4.16 28.45,11.18 31.01,13.74 SPARTAN-3.P52 31.01,18.48 30.52,18.97 29.68,18.97 v29.59,19.05 | JP3.22 50.16,31.5 48.1,29.44 SPARTAN-3.P94 | JP2.22 14.99,23.88 17.05,25.94 SPARTAN-3.P22 22.63,25.94 v23.62,26.92 | 34.52,29.44 v35.69,30.61
  Top 0.305: SPARTAN-3.P94 34.52,29.44 34.52,38.78 SPARTAN-3.P122
  Top 0.813: C2.+ 1.95,53.74 C23.1 8.28,53.66 1117.3 v7.11,51.31 | 34.52,29.44 34.52,27.15 34.42,27.05 | 34.42,27.05 29.59,22.23 v29.59,19.05 | C25.+ 44.47,15.47 34.42,25.53 34.42,27.05
  Bottom 0.203: v29.59,19.05 30.85,19.05 C7.1 | C6.1 23.62,27.3 v23.62,26.92 | v35.69,30.61 35.69,27.87 C4.1
  Bottom 0.813: C5.1 14.82,28.57 17.41,28.57 C6.1 | C5.1 14.31,31.41 7.11,38.61 v7.11,51.31 | C5.1 14.22,27.73 14.22,26.92 9.78,22.48 9.78,19.81 15.62,13.97 26.16,13.97 29.59,17.4 v29.59,19.05
VCCIO  (via drill 0.5, 0.8)  (1 unrouted)
  Top 0.203: JP4.30 46.23,6.1 45.47,6.86 44.96,6.86 38.02,13.79 38.02,16.57 SPARTAN-3.P66 38.01,19.27 v37.97,19.3 | JP4.25 39.88,3.56 39.88,9.4 35.51,13.77 SPARTAN-3.P61 35.51,18.34 v34.67,19.18 | JP4.4 13.21,5.84 15.75,8.38 19.56,8.38 25.01,13.83 SPARTAN-3.P40 25.01,17.9 v26.67,19.56 | JP2.36 4.57,6.1 17.41,18.94 SPARTAN-3.P36 22.87,18.94 v23.37,19.43 | JP2.23 2.54,21.34 3.81,22.61 14.35,22.61 17.18,25.44 SPARTAN-3.P23 24.22,25.44 v25.4,25.4 | JP2.14 13.35,34.04 17.45,29.94 SPARTAN-3.P14 23.53,29.94 v23.62,29.84 | JP3.14 52.32,21.34 48.26,25.4 43.39,25.4 SPARTAN-3.P86 40.68,25.44 v40.64,25.4 | JP1.9 53.59,44.2 58.67,49.28 JP3.36 v56.64,49.28 | SPARTAN-3.P136 27.51,36.4 v27.43,36.32 | SPARTAN-3.P133 29.01,36.63 v28.7,36.32 | SPARTAN-3.P119 36.01,36.13 v35.94,36.07 | C19.+ 27.71,52.43 28.19,51.94 QG1.1 QG1.4 | SPARTAN-3.P108 41.02,36.44 C12.1 39.89,34.05 v39.88,34.04 | v39.75,30.48 40.3,29.94 SPARTAN-3.P95 47.97,29.94 50.8,32.77 v56.64,32.77 60.2,32.77 JP3.23 | LM1086.2 19.3,61.34 19.3,62.23 v17.65,63.88 | v38.61,60.07 40.83,60.07 R4.2
  Top 0.305: R4.2 44.07,59.75 | 44.07,59.75 R1.1 | 44.07,59.75 R3.2
  Top 0.813: 26.39,52.45 C19.+ 26.27,52.58 23.75,52.58 21.72,50.55 20.19,50.55 19.56,49.53 17.53,47.5 v17.53,43.31 | C22.1 19.3,63.75 19.3,61.34 | C24.+ 19.79,15.09 24.13,19.43 v23.37,19.43
  Bottom 0.203: v37.97,19.3 36.66,19.3 C13.1 | v34.67,19.18 34.05,19.18 C16.1 | v27.43,36.32 27.43,34.36 C21.1 | v35.94,36.07 35.94,34.6 C9.1 | v23.62,29.84 C11.1 | v23.37,19.43 23.37,20.32 23.11,20.58 | v26.67,19.56 25.44,19.56 C10.1 25.1,19.27 25.01,19.18 | v40.64,25.4 39.88,25.4 39.31,25.97 | v39.88,34.04 39.88,34.8 40.39,35.31 | v39.75,30.48 41.15,30.48 41.27,30.35 | v17.65,63.88 17.65,60.07 22.73,54.99 29.08,54.99 30.35,53.72 37.34,53.72 39.24,55.63 39.24,59.44 v38.61,60.07 | v56.64,32.77 v56.64,49.28
  Bottom 0.406: 32,25.4 32,24.87
  Bottom 0.813: v25.4,25.4 24.51,25.4 | v25.4,25.4 29.34,25.4 | 29.34,25.4 32,25.4 38.61,25.4 | v17.53,43.31 17.41,43.2 17.41,36.96 18.05,36.32 23.24,36.32 | 33.47,19.39 C13.1 | 33.47,19.39 C16.1 | 33.47,19.39 33.47,20.27 38.61,25.4 | v35.94,36.07 28.96,36.07 v28.7,36.32 v27.43,36.32 23.24,36.32 | 23.24,25.4 v25.4,25.4 | C11.1 25.39,34.18 23.24,36.32 | v23.62,29.84 24.89,29.84 29.34,25.4 | 25.01,22.48 25.01,23.63 23.24,25.4 | 25.01,22.48 25.01,19.18 25.01,19.13 | C14.1 22.82,20.29 23.11,20.58 25.01,22.48 | 38.61,25.4 38.73,25.4 39.31,25.97 39.75,26.42 C17.1 39.77,27.69 40.51,27.69 41.27,28.45 41.27,30.35 41.27,32.75 | C12.1 40.39,35.31 41.02,35.31 41.27,35.05 41.27,32.75 | 41.27,32.75 C15.1 | 23.24,25.4 20.34,25.4 C20.1

### Text on the board
_tsilk: FPGA DEV BOARD